# EAGLE design Ball Detection v4 (EAGLE 9.4.2)
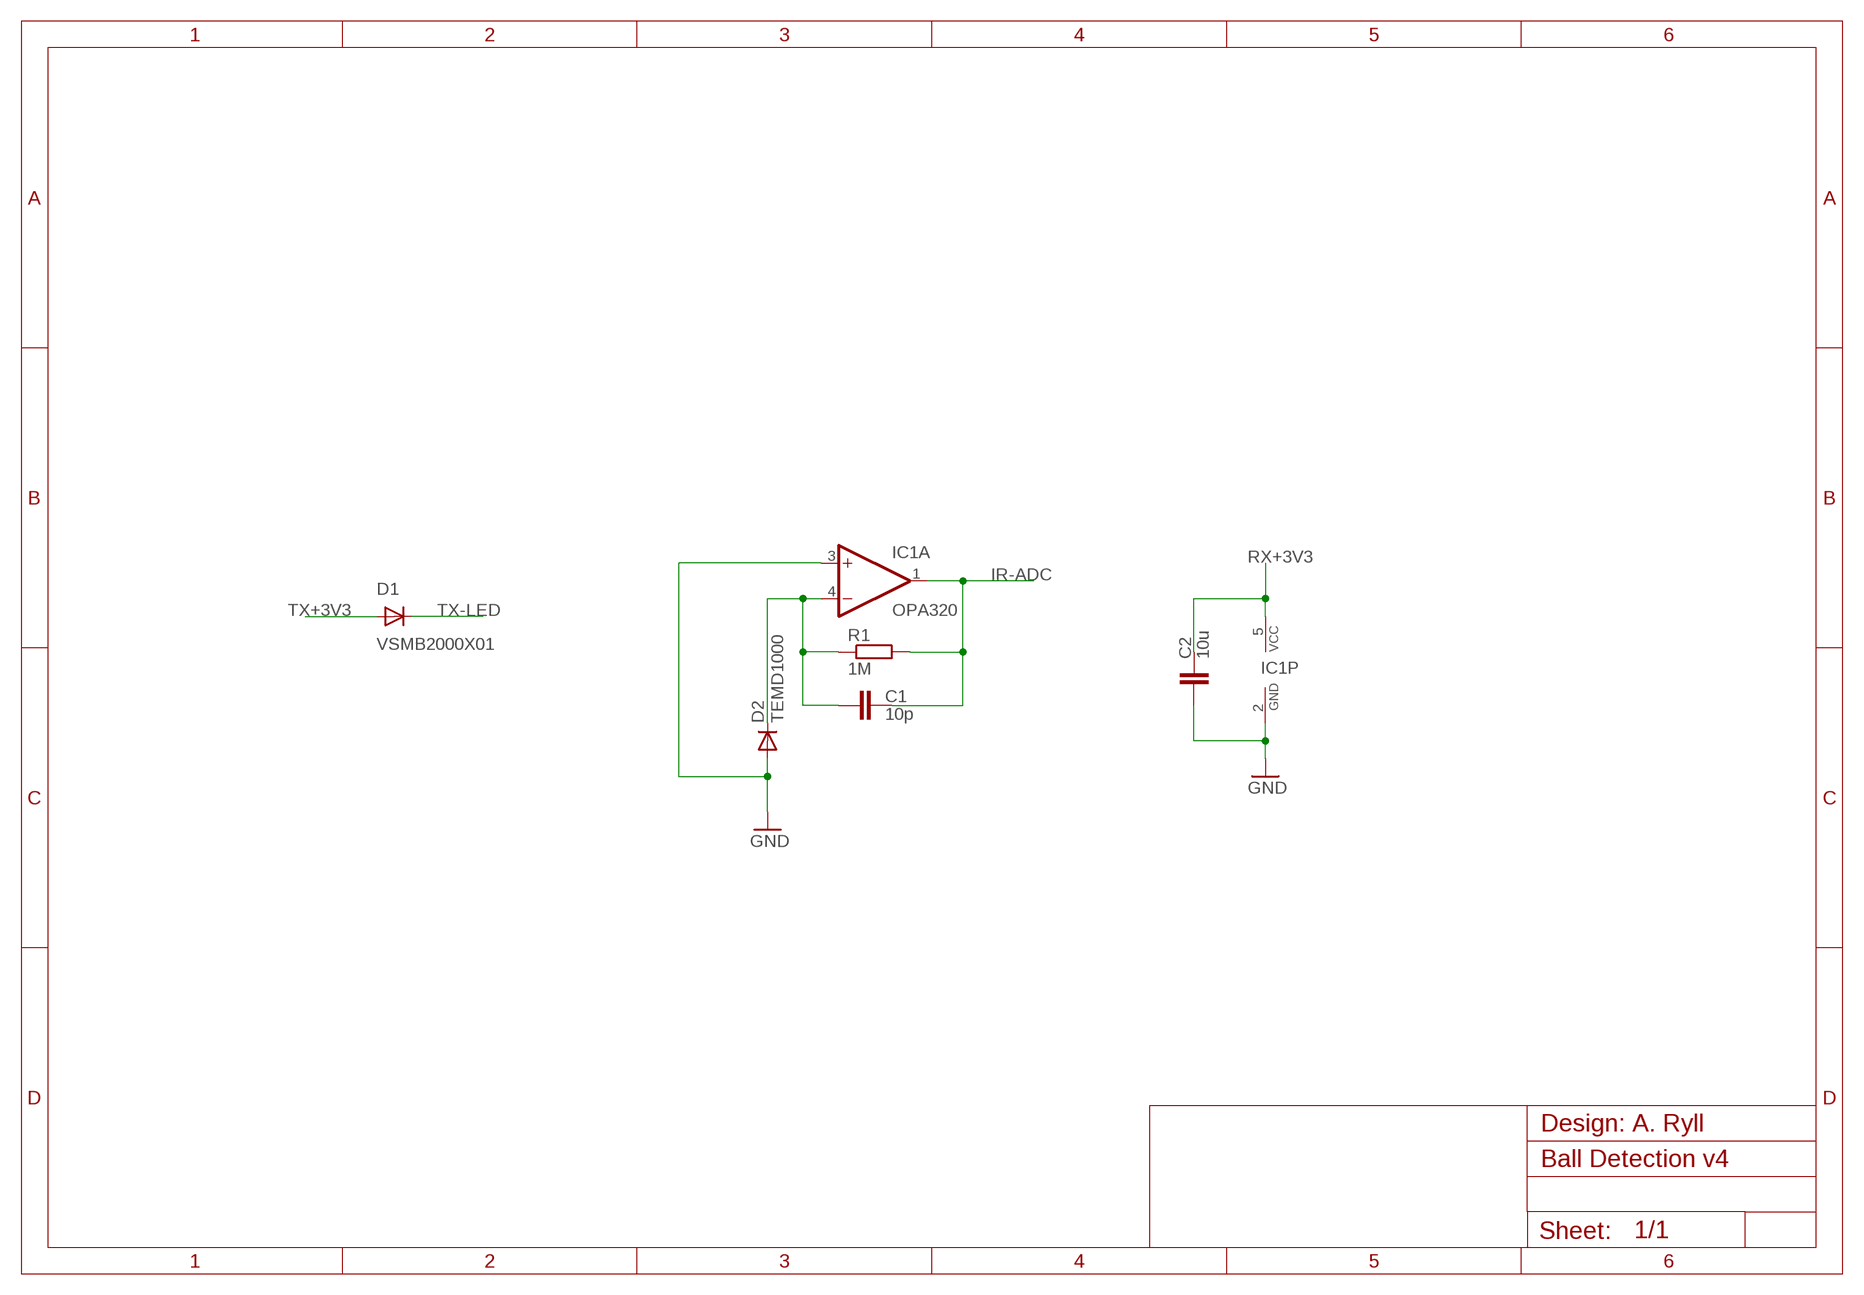
[diagram p0: schematic, sheet 1]

## Parts
C1  10p  C-EUC0603  [C0603]
C2  10u  C-EUC0603  [C0603]
D1  VSMB2000X01  DIODE  [LED-GULLR]
D2  TEMD1000  DIODE  [LED-GULLR]
IC1  OPA320  AD-OP1RT  [SOT23-5]
R1  1M  R-EU_R0603  [R0603]

## Nets
GND: C2.1 D2.A IC1.2(P:GND) IC1.3(A:+IN)
IR-ADC: C1.2 IC1.1(A:OUT) R1.2
N$114: C1.1 D2.C IC1.4(A:-IN) R1.1
RX+3V3: C2.2 IC1.5(P:VCC)
TX+3V3: D1.A
TX-LED: D1.C

## Notes on the sheet
- Design: A. Ryll

## Library data of the parts
C1 C2 = rcl:C-EU: CAPACITOR, European symbol
D1 D2 = Marvin:DIODE
IC1 = Marvin:AD-OP1
R1 = rcl:R-EU_: RESISTOR, European symbol

## Net classes
0 default: width 0.152 mm, clearance 0.152 mm

## Board
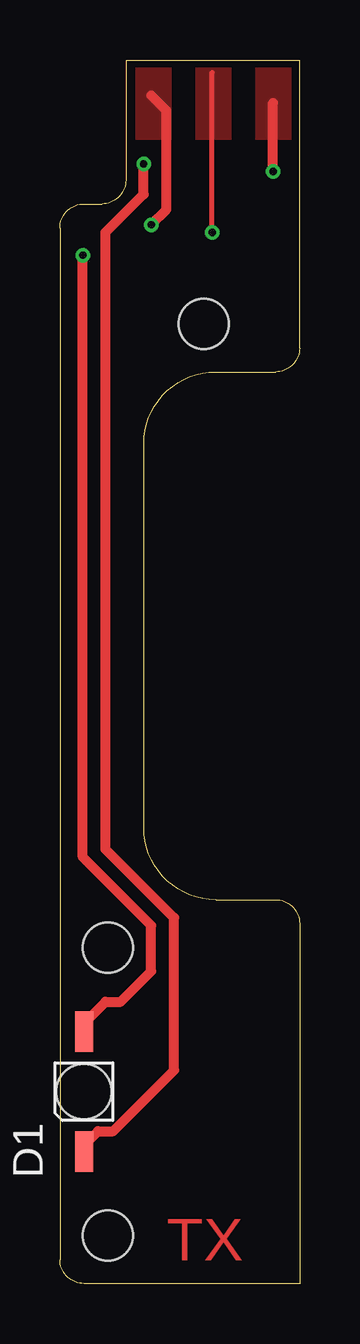
[diagram p1: board, top side]
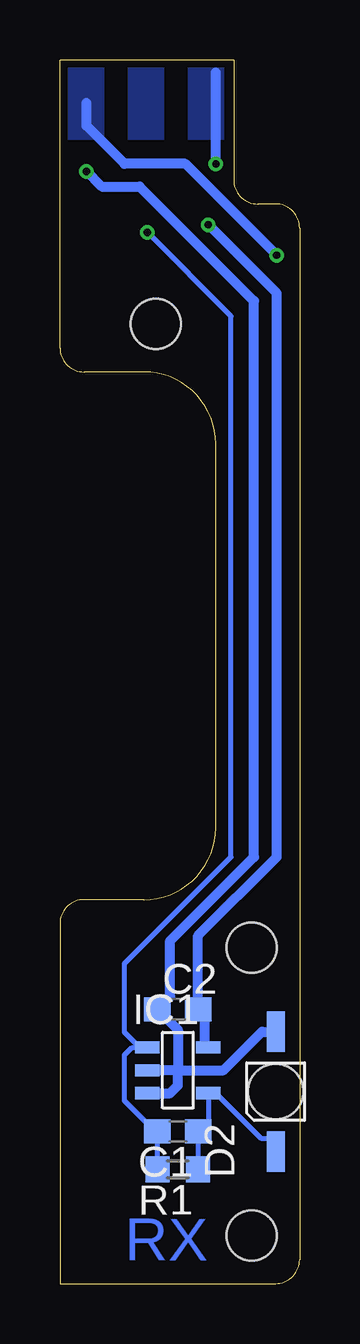
[diagram p2: board, bottom side, seen from below]

Size 10 x 51 mm. Coordinates in mm from the lower left corner, seen from the top.
Outline: 2.75,51 10,51 10,39 arc-90 9,38 6.5,38 arc90 3.5,35 3.5,19 arc90 6.5,16 9,16 arc-90 10,15 10,0 1,0 arc-90 0,1 0,44 arc-90 1,45 1.75,45 arc90 2.75,46 2.75,51
Copper layers (1*16): Top 0.035mm / dielectric 1.5mm / Bottom 0.035mm
Design rules "PCB-POOL Standard *": minimum track width 0.15mm, minimum drill 0.3mm, track to track 0.15mm, track to pad 0.15mm, pad to pad 0.15mm, via to via 0.15mm, smd to smd 0.15mm, copper to edge 0.3mm, drill to drill 0.2mm, minimum pad ring 0.2mm, minimum via ring 0.15mm, stop-mask expansion 0.075mm, vias tented up to drill 14mil, thermal gap 0.2mm
Holes 2.1 mm at 2,2 2,14 6,40
tKeepout: area 4,38 to 8,42

### Footprints (pad centres in the part's own frame; a part is rotated, then mirrored left to right if it is on the bottom)
C0603 = smd 1.1 x 1: 1 -0.85,0; 2 0.85,0
LED-GULLR = smd 1.7 x 0.75: A 2.5,0; C -2.5,0 | hole 2.3: 0,0
SOT23-5 = smd 1.016 x 0.508: 1 -1.27,0.953; 2 -1.27,0; 3 -1.27,-0.953; 4 1.27,-0.953; 5 1.27,0.953
R0603 = smd 1 x 1.1: 1 -0.85,0; 2 0.85,0

### Placement (x,y rotation side)
C1  5.08,6.35 180 bottom
C2  5.08,11.43 0 bottom
D1  1,8 90 top
D2  1,8 90 bottom
IC1  5.08,8.89 0 bottom
R1  5.08,4.76 180 bottom

### Tracks (layer width: path | path; a pad name or v marks a point on that pad's centre or on a via)
GND  (via drill 0.3)
  Top 0.406: v8.89,46.35 8.89,49.21
  Bottom 0.406: 5.08,8.89 5.08,10.58 C2.1 5.4,11.96 5.4,14.29 1.91,17.78 1.91,40.96 6.67,45.72 8.26,45.72 v8.89,46.35 | 5.08,8.89 3.17,8.89 1.56,10.5 D2.A | 5.08,8.89 IC1.2 | IC1.3 5.4,7.94 5.08,8.26 5.08,8.89
  pour Top (no thermals): 8.15,50.7 8.15,47.7 9.65,47.7 9.65,50.7
IR-ADC  (via drill 0.3)
  Top 0.203: v6.35,43.81 6.35,50.48
  Bottom 0.203: R1.2 C1.2 6.03,6.35 7.3,7.62 7.3,9.53 6.99,9.84 IC1.1 6.67,9.84 7.3,10.48 7.3,13.34 2.86,17.78 2.86,40.32 v6.35,43.81
  pour Top (no thermals): 5.65,50.7 5.65,47.7 7.15,47.7 7.15,50.7
N$114
  Bottom 0.203: D2.C 1.27,5.77 1.27,6.03 1.59,6.03 3.49,7.94 IC1.4 3.81,6.35 C1.1 R1.1
NC
  pour Bottom (no thermals): 7.15,50.7 7.15,47.7 5.65,47.7 5.65,50.7
RX+3V3  (via drill 0.3)
  Top 0.406: v3.81,44.13 4.45,44.77 4.45,48.9 3.81,49.53
  Bottom 0.406: IC1.5 3.97,10 3.97,11.17 C2.2 4.23,14.5 0.95,17.78 0.95,41.27 v3.81,44.13
  pour Top (no thermals): 3.15,50.7 3.15,47.7 4.65,47.7 4.65,50.7
TX+3V3  (via drill 0.3)
  Top 0.406: D1.A 1,10.84 1.91,11.75 2.54,11.75 3.81,13.02 3.81,14.92 0.95,17.78 v0.95,42.86
  Bottom 0.406: v0.95,42.86 4.76,46.67 7.3,46.67 8.89,48.26 8.89,49.21
  pour Bottom (no thermals): 9.65,50.7 9.65,47.7 8.15,47.7 8.15,50.7
TX-LED  (via drill 0.3)
  Top 0.406: D1.C 1,5.76 1.58,6.35 2.22,6.35 4.76,8.89 4.76,15.24 1.91,18.1 1.91,43.81 3.49,45.4 v3.49,46.67
  Bottom 0.406: v3.49,46.67 3.49,50.48
  pour Bottom (no thermals): 4.65,50.7 4.65,47.7 3.15,47.7 3.15,50.7

### Text on the board
Top: TX
Bottom: RX